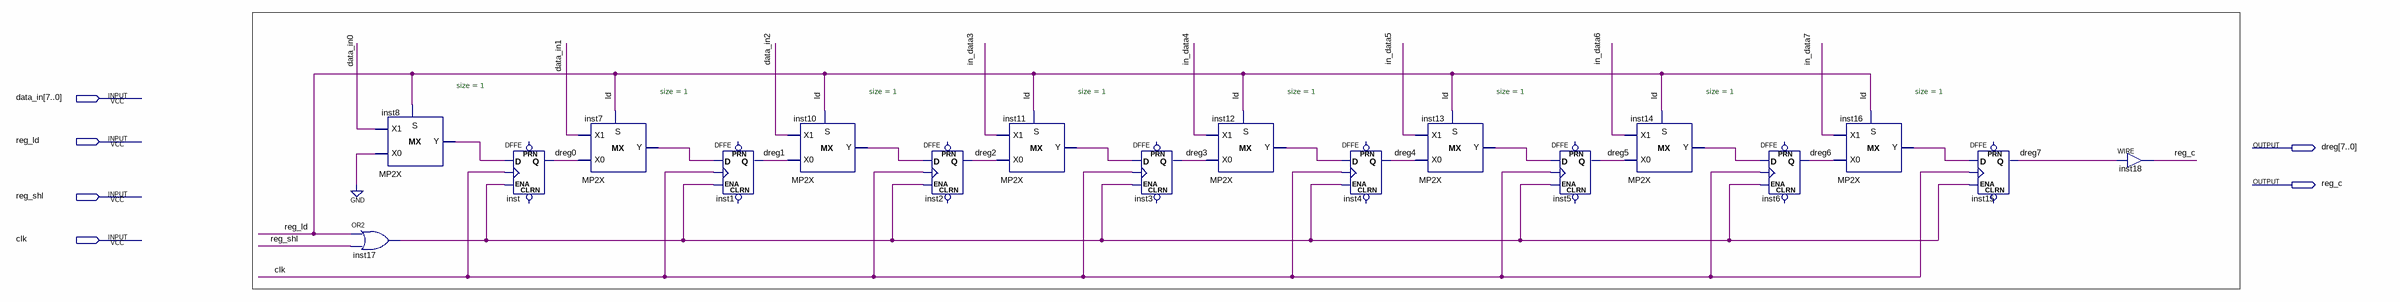
[diagram p0: schematic sheet]
// Quartus schematic reg8.bdf as structural Verilog: 18 symbols, 6 pins
module reg8 (
  input  [7:0] data_in,
  input  reg_ld,
  input  reg_shl,
  input  clk,
  output [7:0] dreg,
  output reg_c
);

  wire in_data3, in_data4, in_data5, in_data6, in_data7, inst7_y, inst8_y, inst10_y, inst11_y, inst12_y,
       inst13_y, inst14_y, inst16_y, inst17_out;

  or inst17 (inst17_out, reg_ld, reg_shl);
  MP2X #(.size(1)) inst8 (.S(reg_ld), .X0(1'b0), .X1(data_in[0]), .Y(inst8_y));
  DFFE inst (.D(inst8_y), .CLK(clk), .ENA(inst17_out), .Q(dreg[0]));  // open: PRN, CLRN
  MP2X #(.size(1)) inst7 (.S(reg_ld), .X0(dreg[0]), .X1(data_in[1]), .Y(inst7_y));
  DFFE inst1 (.D(inst7_y), .CLK(clk), .ENA(inst17_out), .Q(dreg[1]));  // open: PRN, CLRN
  MP2X #(.size(1)) inst10 (.S(reg_ld), .X0(dreg[1]), .X1(data_in[2]), .Y(inst10_y));
  DFFE inst2 (.D(inst10_y), .CLK(clk), .ENA(inst17_out), .Q(dreg[2]));  // open: PRN, CLRN
  MP2X #(.size(1)) inst11 (.S(reg_ld), .X0(dreg[2]), .X1(in_data3), .Y(inst11_y));
  DFFE inst3 (.D(inst11_y), .CLK(clk), .ENA(inst17_out), .Q(dreg[3]));  // open: PRN, CLRN
  MP2X #(.size(1)) inst12 (.S(reg_ld), .X0(dreg[3]), .X1(in_data4), .Y(inst12_y));
  DFFE inst4 (.D(inst12_y), .CLK(clk), .ENA(inst17_out), .Q(dreg[4]));  // open: PRN, CLRN
  MP2X #(.size(1)) inst13 (.S(reg_ld), .X0(dreg[4]), .X1(in_data5), .Y(inst13_y));
  DFFE inst5 (.D(inst13_y), .CLK(clk), .ENA(inst17_out), .Q(dreg[5]));  // open: PRN, CLRN
  MP2X #(.size(1)) inst14 (.S(reg_ld), .X0(dreg[5]), .X1(in_data6), .Y(inst14_y));
  DFFE inst6 (.D(inst14_y), .CLK(clk), .ENA(inst17_out), .Q(dreg[6]));  // open: PRN, CLRN
  MP2X #(.size(1)) inst16 (.S(reg_ld), .X0(dreg[6]), .X1(in_data7), .Y(inst16_y));
  DFFE inst15 (.D(inst16_y), .CLK(clk), .ENA(inst17_out), .Q(dreg[7]));  // open: PRN, CLRN
  assign reg_c = dreg[7];  // WIRE inst18

  // Other names for the same wires on the sheet: ld = reg_ld
endmodule
